# EasyEDA schematic 1-Schematic_light_panel.json
TITLE: rgblight配套灯板; REV: 1.0; Date: 2021-10-04; Sheet: 1/1; Drawn By: WC; Company: Dawncraft-loT
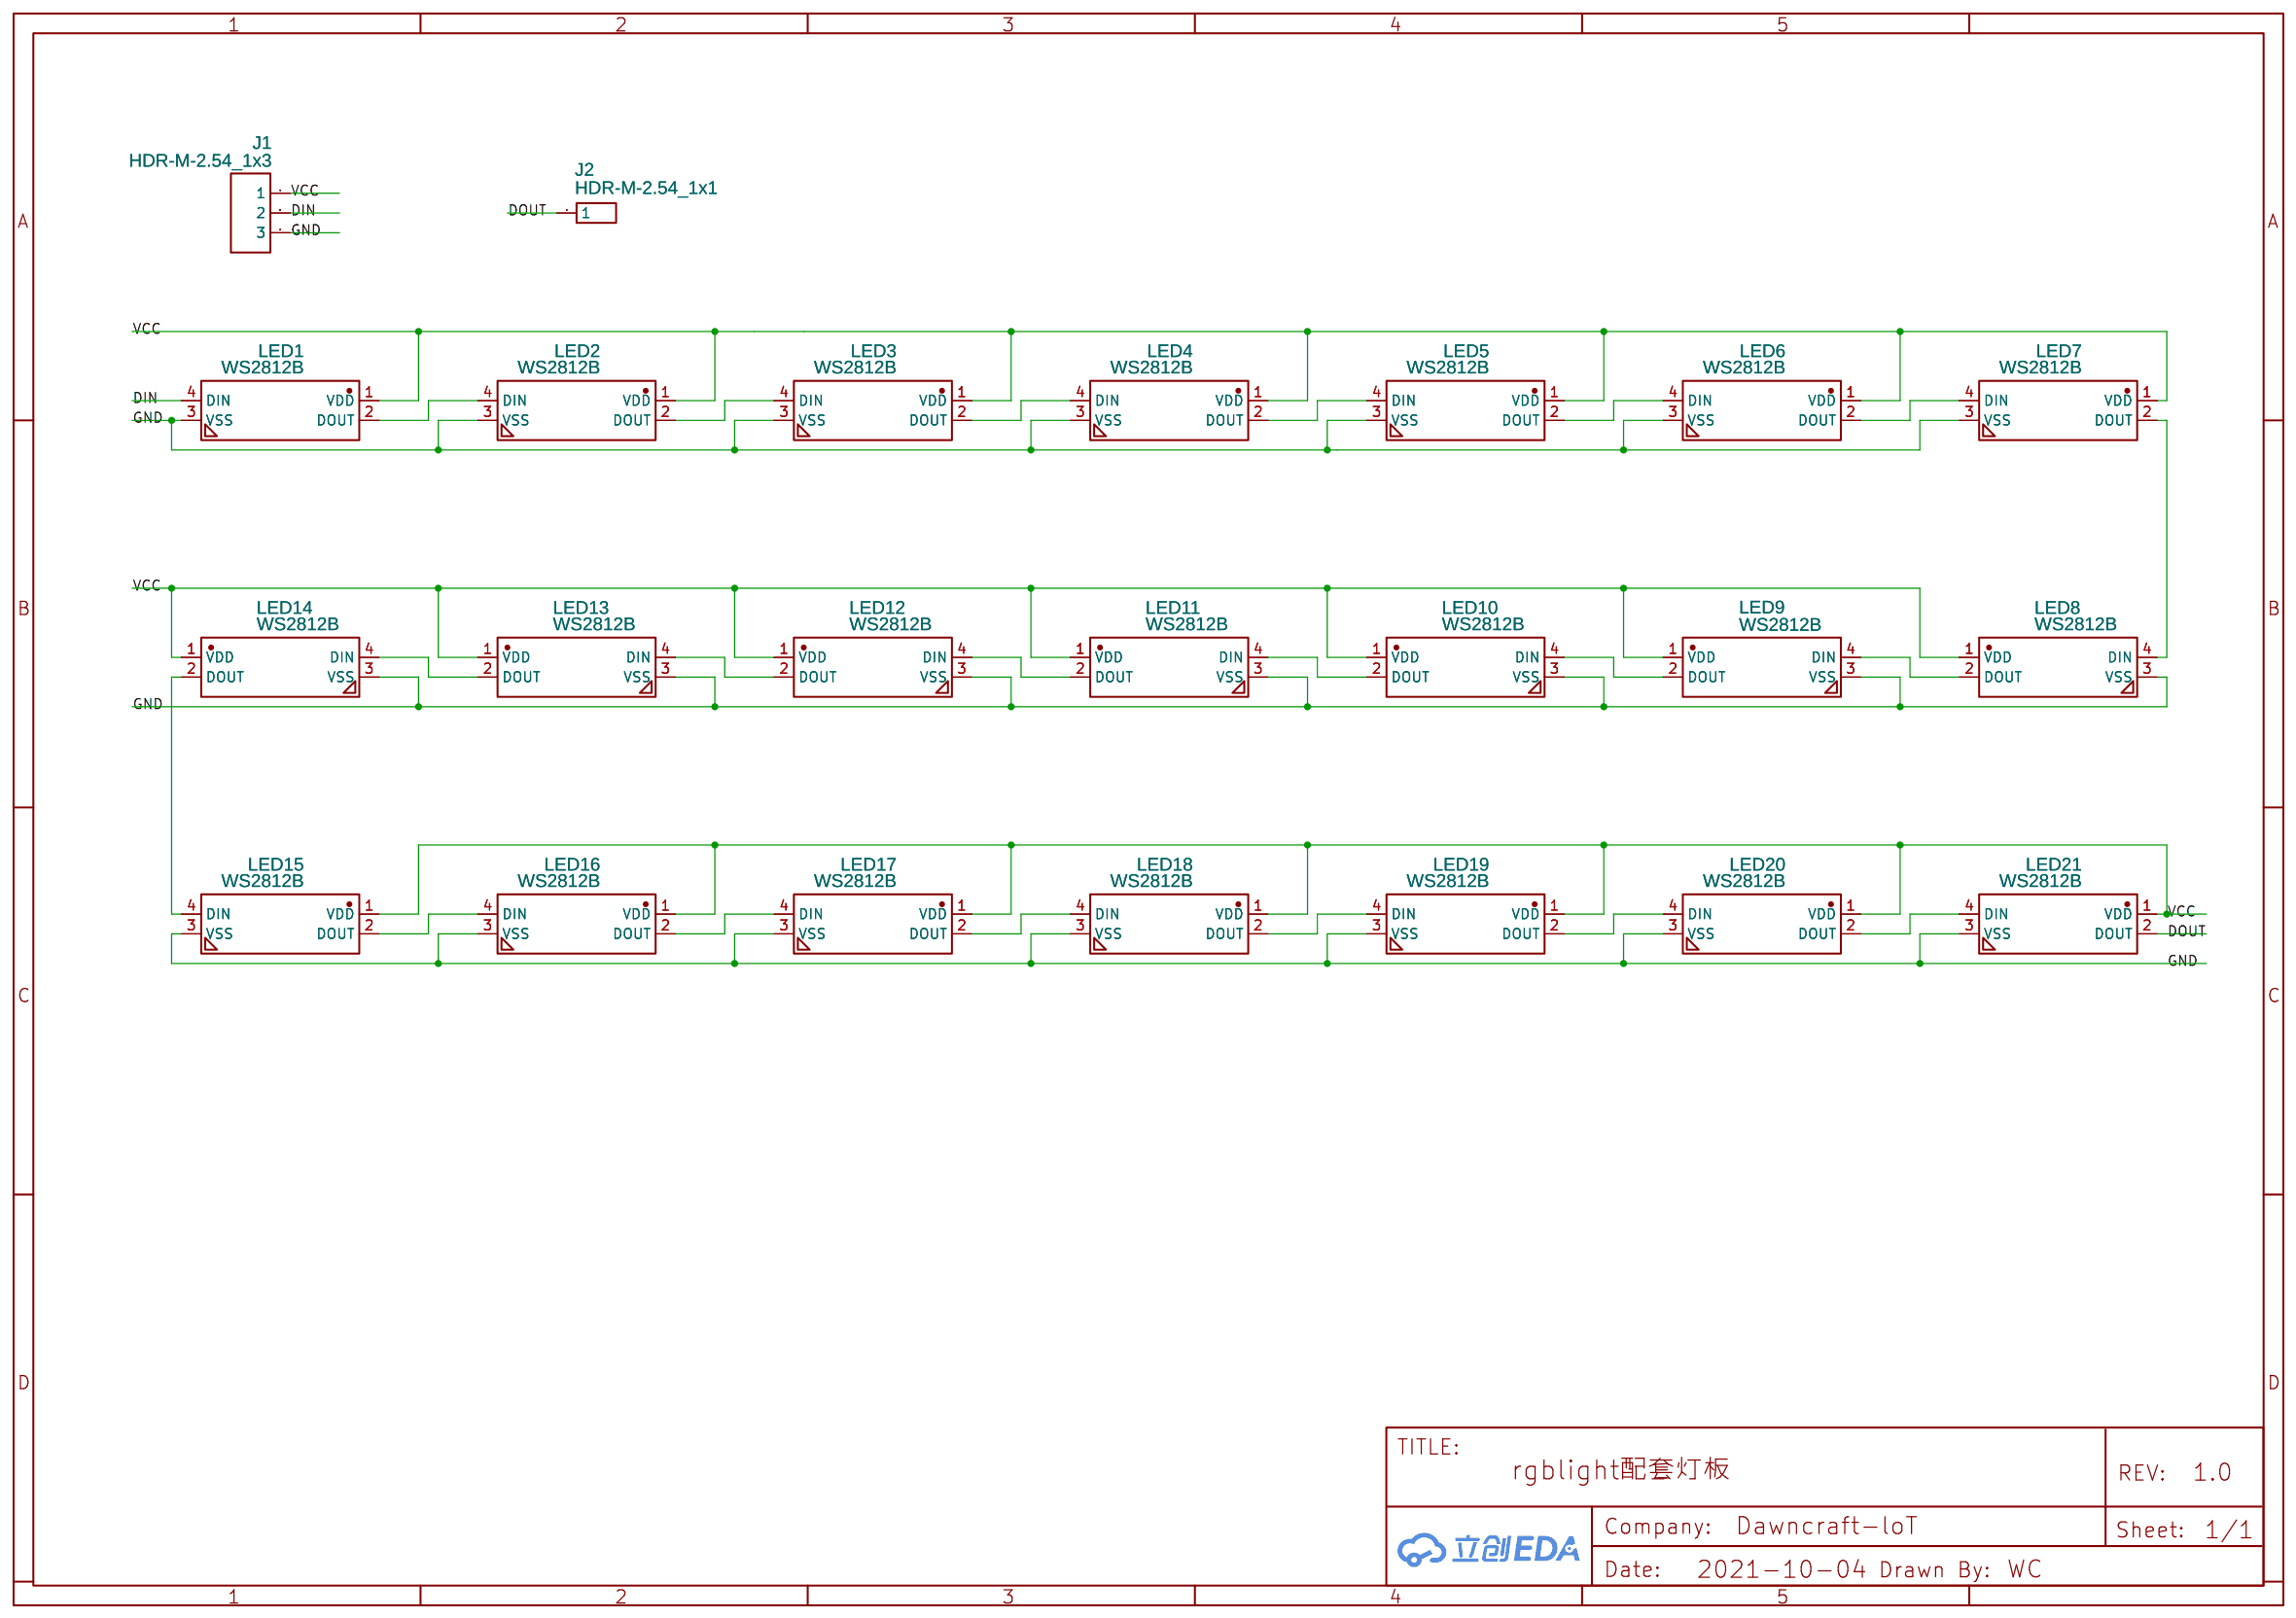
[diagram p0: schematic sheet]

## Parts
J1  HDR-M-2.54_1x3  [HDR-M-2.54_1X3]
J2  HDR-M-2.54_1x1  [HDR-M-2.54_1X1]
LED1  WS2812B  [LED-SMD_4P-L5.0-W5.0-TL]
LED2  WS2812B  [LED-SMD_4P-L5.0-W5.0-TL]
LED3  WS2812B  [LED-SMD_4P-L5.0-W5.0-TL]
LED4  WS2812B  [LED-SMD_4P-L5.0-W5.0-TL]
LED5  WS2812B  [LED-SMD_4P-L5.0-W5.0-TL]
LED6  WS2812B  [LED-SMD_4P-L5.0-W5.0-TL]
LED7  WS2812B  [LED-SMD_4P-L5.0-W5.0-TL]
LED8  WS2812B  [LED-SMD_4P-L5.0-W5.0-TL]
LED9  WS2812B  [LED-SMD_4P-L5.0-W5.0-TL]
LED10  WS2812B  [LED-SMD_4P-L5.0-W5.0-TL]
LED11  WS2812B  [LED-SMD_4P-L5.0-W5.0-TL]
LED12  WS2812B  [LED-SMD_4P-L5.0-W5.0-TL]
LED13  WS2812B  [LED-SMD_4P-L5.0-W5.0-TL]
LED14  WS2812B  [LED-SMD_4P-L5.0-W5.0-TL]
LED15  WS2812B  [LED-SMD_4P-L5.0-W5.0-TL]
LED16  WS2812B  [LED-SMD_4P-L5.0-W5.0-TL]
LED17  WS2812B  [LED-SMD_4P-L5.0-W5.0-TL]
LED18  WS2812B  [LED-SMD_4P-L5.0-W5.0-TL]
LED19  WS2812B  [LED-SMD_4P-L5.0-W5.0-TL]
LED20  WS2812B  [LED-SMD_4P-L5.0-W5.0-TL]
LED21  WS2812B  [LED-SMD_4P-L5.0-W5.0-TL]

## Library data of the parts
J1 = HDR-M-2.54_1x3: Supplier Part: C180248; Supplier: LCSC; Contributor: LCEDA_Lib
J2 = HDR-M-2.54_1x1: Supplier Part: C81276; Supplier: LCSC; Contributor: LCEDA_Lib
LED1-LED21 = WS2812B: Supplier: LCSC; Manufacturer: Worldsemi; Contributor: LCSC; Supplier Part: C114585; JLCPCB Part Class: Extended Part

## Nets
GND: J1.3 LED1.3(VSS) LED2.3(VSS) LED3.3(VSS) LED4.3(VSS) LED5.3(VSS) LED6.3(VSS) LED7.3(VSS) LED8.3(VSS) LED9.3(VSS) LED10.3(VSS) LED11.3(VSS) LED12.3(VSS) LED13.3(VSS) LED14.3(VSS) LED15.3(VSS) LED16.3(VSS) LED17.3(VSS) LED18.3(VSS) LED19.3(VSS) LED20.3(VSS) LED21.3(VSS)
VCC: J1.1 LED1.1(VDD) LED2.1(VDD) LED3.1(VDD) LED4.1(VDD) LED5.1(VDD) LED6.1(VDD) LED7.1(VDD) LED8.1(VDD) LED9.1(VDD) LED10.1(VDD) LED11.1(VDD) LED12.1(VDD) LED13.1(VDD) LED14.1(VDD) LED15.1(VDD) LED16.1(VDD) LED17.1(VDD) LED18.1(VDD) LED19.1(VDD) LED20.1(VDD) LED21.1(VDD)
DIN: J1.2 LED1.4(DIN)
DOUT: J2.1 LED21.2(DOUT)
Net-(LED1-2): LED1.2(DOUT) LED2.4(DIN)
Net-(LED2-2): LED2.2(DOUT) LED3.4(DIN)
Net-(LED3-2): LED3.2(DOUT) LED4.4(DIN)
Net-(LED4-2): LED4.2(DOUT) LED5.4(DIN)
Net-(LED5-2): LED5.2(DOUT) LED6.4(DIN)
Net-(LED6-2): LED6.2(DOUT) LED7.4(DIN)
Net-(LED7-2): LED7.2(DOUT) LED8.4(DIN)
Net-(LED8-2): LED8.2(DOUT) LED9.4(DIN)
Net-(LED9-2): LED9.2(DOUT) LED10.4(DIN)
Net-(LED10-2): LED10.2(DOUT) LED11.4(DIN)
Net-(LED11-2): LED11.2(DOUT) LED12.4(DIN)
Net-(LED12-2): LED12.2(DOUT) LED13.4(DIN)
Net-(LED13-2): LED13.2(DOUT) LED14.4(DIN)
Net-(LED14-2): LED14.2(DOUT) LED15.4(DIN)
Net-(LED15-2): LED15.2(DOUT) LED16.4(DIN)
Net-(LED16-2): LED16.2(DOUT) LED17.4(DIN)
Net-(LED17-2): LED17.2(DOUT) LED18.4(DIN)
Net-(LED18-2): LED18.2(DOUT) LED19.4(DIN)
Net-(LED19-2): LED19.2(DOUT) LED20.4(DIN)
Net-(LED20-2): LED20.2(DOUT) LED21.4(DIN)
